# Altium schematic sheet Sheet4.SchDoc
size A4; SheetNumber: 4; SheetTotal: 4; SPICEModelCacheVZIJWIUZ: <root> / <DocumentId>VZIJWIUZ</DocumentId> / <CacheFrame Number="0"> / <Model Name="q2n2222a" Kind="MDL"> / <Text>.model Q2N2222A NPN(Is=14.34f Xti=3 Eg=1.11 Vaf=74.03 Bf=255.9 Ne=1.307 / +		Ise=14.34f Ikf=.2847 Xtb=1.5 Br=6.092 Nc=2 Isc=0 Ikr=0 Rc=1 / +		Cjc=7.306p Mjc=.3416 Vjc=.75 Fc=.5 Cje=22.01p Mje=.377 Vje=.75 / +		Tr=46.91n Tf=411.1p Itf=.6 Vtf=1.7 Xtf=3 Rb=10)</Text> / </Model> / </CacheFrame> / </root>
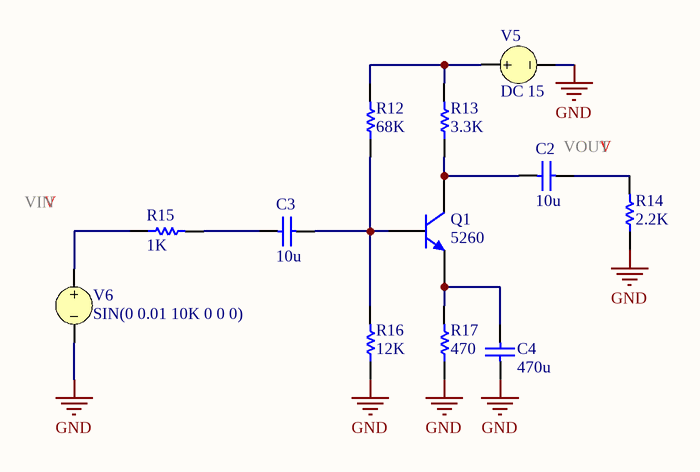
[diagram p0: Sheet4.SchDoc]

## Parts
C2  value 10u  (hidden comment: Capacitor)
C3  value 10u  (hidden comment: Capacitor)
C4  value 470u  (hidden comment: Capacitor)
Q1  Inflow: 5260  [SOT23_N]  (hidden comment: NPN)
R12  value 68K  (hidden comment: Resistor)
R13  value 3.3K  (hidden comment: Resistor)
R14  value 2.2K  (hidden comment: Resistor)
R15  value 1K  (hidden comment: Resistor)
R16  value 12K  (hidden comment: Resistor)
R17  value 470  (hidden comment: Resistor)
V5  DC 15
V6  SIN(0 0.01 10K 0 0 0)

## Nets
GND: C4.1 R14.1 R16.1 R17.1 V5.2 V6.2
NetC2_1: C2.1 R14.2
NetC2_2: C2.2 Q1.3(C) R13.1
NetC3_1: C3.1 R15.2
NetC3_2: C3.2 Q1.1(B) R12.1 R16.2
NetC4_2: C4.2 Q1.2(E) R17.2
NetR12_2: R12.2 R13.2 V5.1
NetR15_1: R15.1 V6.1

## Library data of the parts
C2-C4 = Capacitor: SimulationGenericComponent: True
Q1 = Semi_BJT_2N2222_SMD: NPN Switching Transistors; Rating: Rating?; Type: Type?; Validation: Valid; Value: NPN; Package: Package?
R12-R17 = Resistor: TC1: 0; SimulationGenericComponent: True; TC2: 0
V5 = VSRC: Voltage Source; Note: PCB Footprint - Not required; AC Magnitude: 1; AC Phase: 0; Value: 15; Published: 8-Jun-2000; LatestRevisionDate: 17-Jul-2002; LatestRevisionNote: Re-released for DXP Platform.; PackageReference: Not Applicable; Publisher: Altium Limited
V6 = VSRC: Voltage Source; Note: PCB Footprint - Not required; AC Magnitude: 1; AC Phase: 0; DC Magnitude: 5; Amplitude: 0.01; Published: 8-Jun-2000; LatestRevisionDate: 17-Jul-2002; LatestRevisionNote: Re-released for DXP Platform.; PackageReference: Not Applicable; Publisher: Altium Limited; Offset: 0; Frequency: 10K; Delay: 0; Damping Factor: 0; Phase: 0